# Altium schematic sheet Sheet1.SchDoc
size A4; SheetNumber: 1; SheetTotal: 1
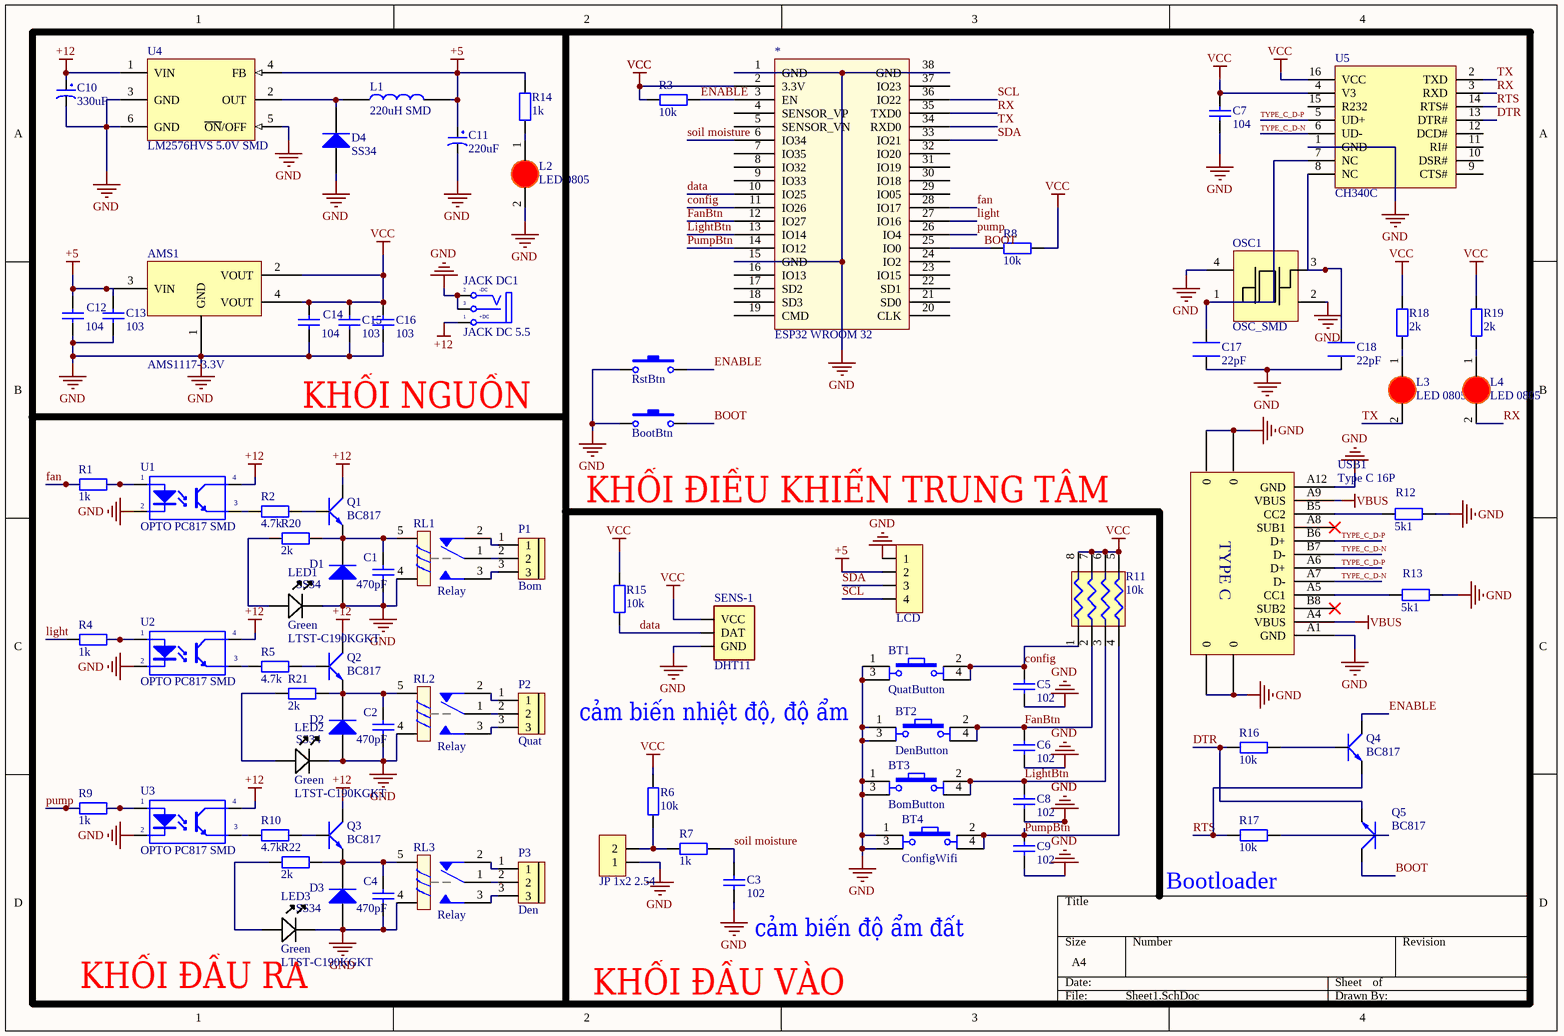
[diagram p0: Sheet1.SchDoc]

## Parts
*  ESP32 WROOM 32  [ESP32-WROOM-32D]
AMS1  AMS1117-3.3V  [SOT223]
BootBtn  Nut Nhan 2 Chan SMD 3x6x2.5  [Nut Nhan 2 Chan SMD 3x6x2.5]  (value not drawn)
BT1  QuatButton  [Nut Nhan 4 Chan SMD 6x6]
BT2  DenButton  [Nut Nhan 4 Chan SMD 6x6]
BT3  BomButton  [Nut Nhan 4 Chan SMD 6x6]
BT4  ConfigWifi  [Nut Nhan 4 Chan SMD 6x6]
C1  470pF  [tu 0603]
C2  470pF  [tu 0603]
C3  102  [tu 0603]
C4  470pF  [tu 0603]
C5  102  [tu 0603]
C6  102  [tu 0603]
C7  104  [tu 0603]
C8  102  [tu 0603]
C9  102  [tu 0603]
C10  330uF  [tu hoa 8mm]
C11  220uF  [tu hoa 6.5mm]
C12  104  [tu 0603]
C13  103  [tu 0603]
C14  104  [tu 0603]
C15  103  [tu 0603]
C16  103  [tu 0603]
C17  22pF  [CAPC1608X09L]
C18  22pF  [CAPC1608X09L]
D1  SS34  [DIODE SMA]
D2  SS34  [DIODE SMA]
D3  SS34  [DIODE SMA]
D4  SS34  [DIODE SMA]
JACK_DC1  JACK DC 5.5  [JACK DC 5.5]
JP1  JP 1x2 2.54  [JP 1x2 DT]
JP?  LCD  [JP 1x4 DT]
L1  220uH SMD  [Cuon Cam 7x7x5]
L2  LED 0805  [LED-0805-Red]
L3  LED 0805  [LED-0805-Red]
L4  LED 0805  [LED-0805-Red]
LED1  Green  [LED-0603-GREEN]
LED2  Green  [LED-0603-GREEN]
LED3  Green  [LED-0603-GREEN]
OSC1  OSC_SMD  [3525 OSC]
P1  Bom  [CON 3 3EDG5.08]
P2  Quat  [CON 3 3EDG5.08]
P3  Den  [CON 3 3EDG5.08]
Q1  BC817  [SOT-23]
Q2  BC817  [SOT-23]
Q3  BC817  [SOT-23]
Q4  BC817  [SOT-23]
Q5  BC817  [SOT-23]
R1  1k  [tro smd 0603]
R2  4.7k  [tro smd 0603]
R3  10k  [tro smd 0603]
R4  1k  [tro smd 0603]
R5  4.7k  [tro smd 0603]
R6  10k  [tro smd 0603]
R7  1k  [tro smd 0603]
R8  10k  [tro smd 0603]
R9  1k  [tro smd 0603]
R10  4.7k  [tro smd 0603]
R11  10k  [tro bang 0603 4]
R12  5k1  [tro smd 0603]
R13  5k1  [tro smd 0603]
R14  1k  [tro smd 0603]
R15  10k  [tro smd 0603]
R16  10k  [tro smd 0603]
R17  10k  [tro smd 0603]
R18  2k  [tro smd 0603]
R19  2k  [tro smd 0603]
R20  2k  [tro smd 0603]
R21  2k  [tro smd 0603]
R22  2k  [tro smd 0603]
RL1  Relay  [Relay 5 Chan SRD]
RL2  Relay  [Relay 5 Chan SRD]
RL3  Relay  [Relay 5 Chan SRD]
RstBtn  Nut Nhan 2 Chan SMD 3x6x2.5  [Nut Nhan 2 Chan SMD 3x6x2.5]  (value not drawn)
SENS-1  DHT11  [SENSOR-DHT11]
U1  OPTO PC817 SMD  [SOP4]
U2  OPTO PC817 SMD  [SOP4]
U3  OPTO PC817 SMD  [SOP4]
U4  LM2576HVS 5.0V SMD  [TO263-5]
U5  CH340C  [SOIC16_50_284_25X90_SMT]
USB1  Type C 16P  [Type C 16P]

## Nets
+5: AMS1.3(VIN) C11.1 C12.1 C13.1 JP?.2 L1.2 R14.2 U4.4(FB)
+12: C10.1 JACK_DC1.1(T) Q1.3(C) Q2.3(C) Q3.3(C) U1.4(C) U2.4(C) U3.4(C) U4.1(VIN)
GND: *.1(GND) *.15(GND) *.38(GND) AMS1.1(GND) BootBtn.1 BT1.1 BT1.3 BT2.1 BT2.3 BT3.1 BT3.3 BT4.1 BT4.3 C1.2 C2.2 C3.2 C4.2 C5.2 C6.2 C7.2 C8.2 C9.2 C10.2 C11.2 C12.2 C13.2 C14.2 C15.2 C16.2 C17.2 C18.2 D1.1(A) D2.1(A) D3.1(A) D4.1(A) JACK_DC1.2(TN) JACK_DC1.3(S) JP1.1 JP?.1 L2.2(K) LED1.K LED2.K LED3.K OSC1.2(VCC) OSC1.4(VCC) R12.2 R13.2 RL1.4 RL2.4 RL3.4 RstBtn.1 SENS-1.P$4(GND) U1.2(K) U2.2(K) U3.2(K) U4.3(GND) U4.5(~{ON}/OFF) U4.6(GND) U5.1(GND) USB1.0 USB1.A1(GND) USB1.A12(GND)
VBUS: USB1.A4(VBUS) USB1.A9(VBUS)
VCC: *.2(3.3V) AMS1.2(VOUT) AMS1.4(VOUT) C7.1 C14.1 C15.1 C16.1 R3.1 R6.2 R8.2 R11.5 R11.6 R11.7 R11.8 R15.2 R18.2 R19.2 SENS-1.P$1(VCC) U5.4(V3) U5.16(VCC)
BOOT: *.25(IO0) BootBtn.2 Q5.3(C) R8.1
config: *.11(IO26) BT1.2 BT1.4 C5.1 R11.1
data: *.10(IO25) R15.1 SENS-1.P$2(DAT)
DTR: Q5.2(E) R16.1 U5.13(DTR#)
ENABLE: *.3(EN) Q4.3(C) R3.2 RstBtn.2
fan: *.28(IO17) R1.1
FanBtn: *.12(IO27) BT2.2 BT2.4 C6.1 R11.2
light: *.27(IO16) R4.1
LightBtn: *.13(IO14) BT3.2 BT3.4 C8.1 R11.3
pump: *.26(IO4) R9.1
PumpBtn: *.14(IO12) BT4.2 BT4.4 C9.1 R11.4
RTS: Q4.2(E) R17.1 U5.14(RTS#)
RX: *.35(TXD0) L4.2(K) U5.3(RXD)
SCL: *.36(IO22) JP?.4
SDA: *.33(IO21) JP?.3
soil moisture: *.6(IO34) C3.1 R7.2
TX: *.34(RXD0) L3.2(K) U5.2(TXD)
TYPE_C_D-N: U5.6(UD-) USB1.A7(D-) USB1.B7(D-)
TYPE_C_D-P: U5.5(UD+) USB1.A6(D+) USB1.B6(D+)
NetC1_1: C1.1 D1.2(K) Q1.2(E) R20.2 RL1.5
NetC2_1: C2.1 D2.2(K) Q2.2(E) R21.2 RL2.5
NetC4_1: C4.1 D3.2(K) Q3.2(E) R22.2 RL3.5
NetC17_1: C17.1 OSC1.1(VCC) U5.7(NC)
NetC18_1: C18.1 OSC1.3(VCC) U5.8(NC)
NetD4_2: D4.2(K) L1.1 U4.2(OUT)
NetJP1_2: JP1.2 R6.1 R7.1
NetL2_1: L2.1(A) R14.1
NetL3_1: L3.1(A) R18.1
NetL4_1: L4.1(A) R19.1
NetLED1_A: LED1.A R20.1
NetLED2_A: LED2.A R21.1
NetLED3_A: LED3.A R22.1
NetP1_1: P1.1 RL1.2
NetP1_2: P1.2 RL1.1
NetP1_3: P1.3 RL1.3
NetP2_1: P2.1 RL2.2
NetP2_2: P2.2 RL2.1
NetP2_3: P2.3 RL2.3
NetP3_1: P3.1 RL3.2
NetP3_2: P3.2 RL3.1
NetP3_3: P3.3 RL3.3
NetQ1_1: Q1.1(B) R2.2
NetQ2_1: Q2.1(B) R5.2
NetQ3_1: Q3.1(B) R10.2
NetQ4_1: Q4.1(B) R16.2
NetQ5_1: Q5.1(B) R17.2
NetR1_2: R1.2 U1.1(A)
NetR2_1: R2.1 U1.3(E)
NetR4_2: R4.2 U2.1(A)
NetR5_1: R5.1 U2.3(E)
NetR9_2: R9.2 U3.1(A)
NetR10_1: R10.1 U3.3(E)
NetR12_1: R12.1 USB1.B5(CC2)
NetR13_1: R13.1 USB1.A5(CC1)

Not connected (* = marked no-connect by the designer): * 4(SENSOR_VP) 5(SENSOR_VN) 7(IO35) 8(IO32) 9(IO33) 16(IO13) 17(SD2) 18(SD3) 19(CMD) 20(CLK) 21(SD0) 22(SD1) 23(IO15) 24(IO2) 29(IO05) 30(IO18) 31(IO19) 32(IO20) 37(IO23); U5 9(CTS#) 10(DSR#) 11(RI#) 12(DCD#) 15(R232); USB1 A8(SUB1)* B8(SUB2)*

## Notes on the sheet
- KHỐI NGUỒN
- KHỐI ĐIỀU KHIỂN TRUNG TÂM
- cảm biến nhiệt độ, độ ẩm
- (near R17) Bootloader
- (near C3) cảm biến độ ẩm đất
- (near LED3) KHỐI ĐẦU RA
- KHỐI ĐẦU VÀO
- (in symbol JACK DC 5.5) -DC; +DC
- (in symbol Type C 16P) TYPE C

## Library data of the parts
AMS1 = AMS1117 SMD: Dán; Value: AMS1117-3.3V SOT223; Don_Vi: Con; Ma_Hang: MH000596; Ghi_Chu: *; Kieu_Chan: *; Chung_Loai: Dán
BootBtn RstBtn = Nut Nhan 2 Chan SMD 3x6x2.5: Ma_Hang: MH001036; Ten: Nút Nhấn 2 Chân 3x6x2.5MM SMD
BT1-BT4 = Nut Nhan 4 Chan SMD 6x6: Nut Nhan 4 Chan 6.2x6.2x3.5; Ten: Nút Nhấn 4 Chân 6.2x6.2x3.1MM SMD; Ma_Hang: MH002424
C1 C2 C4 = Tu 0603 470pF 50V 10%: Dán; Don_Vi: Con; So_Chan: 2; Ten_Linh_Kien: Tụ 0603 470P 50V 10%; Ma_Hang: MH004571; Chung_Loai: Dán; Kieu_Chan: *
C3 C5 C6 C8 C9 = Tu 0603 102 50V 10%: Dán; Don_Vi: Con; So_Chan: 2; Ten_Linh_Kien: Tụ 0603 102-1nF 10% 50V; Ma_Hang: MH004566; Chung_Loai: Dán; Kieu_Chan: *
C7 C12 C14 = Tu 0603 104 50V 10%: Dán; Don_Vi: Con; So_Chan: 2; Ten_Linh_Kien: Tụ 0603 104-100nF 10% 50V; Ma_Hang: MH004568; Chung_Loai: Dán; Kieu_Chan: *
C10 = Tu Hoa 330uF 25V 8x11: Cắm; Don_Vi: Con; So_Chan: 2; Ten_Linh_Kien: Tụ Hóa 330nF 25V 8x11MM; Ma_Hang: MH006566; Chung_Loai: Cắm; Kieu_Chan: *
C11 = Tu Hoa 220uF 16V 7x11: Cắm; Don_Vi: Con; Ten_Linh_Kien: Tụ Hóa 220uF 16V 7x11MM; So_Chan: 2; Ma_Hang: MH008416; Chung_Loai: Cắm; Kieu_Chan: *
C13 C15 C16 = Tu 0603 103 50V 10%: Dán; Don_Vi: Con; So_Chan: 2; Ten_Linh_Kien: Tụ 0603 103-10nF 10% 50V; Ma_Hang: MH004567; Chung_Loai: Dán; Kieu_Chan: *
C17 C18 = GRM1885C1H222JA01D: CAP CER 2200PF 50V NP0 0603; Manufacturer: Murata Electronics North America; Tolerance: ±5%; Temperature Coefficient: C0G, NP0; Supplier 1: Digi-Key; Supplier Part Number 1: 490-1459-1-ND; RoHS: RoHS Compliant; Category: Capacitors; Stock 1: 850589; Pricing 1: 1=0.11, 10=0.08, 25=0.058, 50=0.0434, 100=0.0355, 250=0.02972, 500=0.02536, 1000=0.01992 (USD); Packaging: Cut Tape (CT); Capacitance: 2200pF; Voltage - Rated: 50V; Mounting Type: Surface Mount, MLCC; Operating Temperature: -55°C ~ 125°C; Applications: General Purpose; Ratings: -; Package / Case: 0603 (1608 Metric); Size / Dimension: 0.063" L x 0.031" W (1.60mm x 0.80mm); Height - Seated (Max): -; Thickness (Max): 0.035" (0.90mm); Lead Spacing: -; Features: -; Lead Style: -; ComponentLink1URL: http://www.murata.com/~/media/webrenewal/support/library/catalog/products/capacitor/mlcc/c02e.ashx; ComponentLink1Description: http://www.murata.com/~/media/webrenewal/support/library/catalog/products/capacitor/mlcc/c02e.ashx; Part Status: Active
D1-D4 = Diode SS34 ( 1N5822 ): Dán; Don_Vi: Con; Ma_Hang: MH002104; Ten_Linh_Kien: Diode SS34 3A 40V SMA ( 1N5822 SS34A); Kieu_Chan: *; Chung_Loai: Dán
JACK_DC1 = JACK DC 5.5: Value: Jac DC
JP1 = JP 1x2 2.54 Duc Thang: Cắm; Ten_Linh_Kien: Jump Đơn Đực 2.54MM 1x40P Thẳng 11MM; Don_Vi: Con; Ma_Hang: MH000903; Ghi_Chu: *; Kieu_Chan: *; Chung_Loai: Cắm
JP? = JP 1x4 2.54 Duc Thang: Cắm; Ten_Linh_Kien: Jump Đơn Đực 2.54MM 1x40P Thẳng 11MM; Don_Vi: Con; Ma_Hang: MH000903; Ghi_Chu: *; Kieu_Chan: *; Chung_Loai: Cắm
L1 = CUON CAM 47uH SMD: Dán; Don_Vi: Con; Ma_Hang: MH004211; Ten_Linh_Kien: Cuộn Cảm 47uH 7x7x4MM CD74R; Ghi_Chu: *; Kieu_Chan: *; Chung_Loai: Dán
L2-L4 = LED 0805 Do: Dán; Don_Vi: Con; Ma_Hang: MH000897; Ten_Linh_Kien: LED 0805 Màu Đỏ (Red); Ghi_Chu: *; Kieu_Chan: *; Chung_Loai: Dán
LED1-LED3 = LTST-C190KGKT: LED GREEN CLEAR 0603 SMD; Manufacturer: Lite-On Inc.; Lens Color: Colorless; Millicandela Rating: 35mcd; Lens Style/Size: Rectangle with Flat Top, 1.10mm x 0.80mm; Voltage - Forward (Vf) (Typ): 2V; Current - Test: 20mA; Viewing Angle: 130°; Wavelength - Dominant: 571nm; Wavelength - Peak: 574nm; Supplier 1: Digi-Key; Supplier Part Number 1: 160-1435-1-ND; RoHS: RoHS Compliant; Category: Optoelectronics; Stock: 922756; Pricing 1: 1=0.27, 10=0.196, 25=0.1448, 100=0.1034, 250=0.07032, 500=0.06204, 1000=0.0486 (USD); Packaging: Cut Tape (CT); Part Status: Active; Color: Green; Lens Transparency: Clear; Mounting Type: Surface Mount; Features: -; Package / Case: 0603 (1608 Metric); Size / Dimension: 1.60mm L x 0.80mm W; Height (Max): 0.80mm; ComponentLink1URL: http://optoelectronics.liteon.com/upload/download/DS22-2000-074/S_110_LTST-C190KGKT.pdf; ComponentLink1Description: http://optoelectronics.liteon.com/upload/download/DS22-2000-074/S_110_LTST-C190KGKT.pdf; Manufacturer Part Number: LTST-C190KGKT
P1-P3 = CON 3 EDG5.08: Cắm; Ten_Linh_Kien: CON 3 2EDG5.08-3P 5.08MM ( Xanh Cong); Don_Vi: Con; Ma_Hang: MH000760; Ghi_Chu: *; Kieu_Chan: *; Chung_Loai: Cắm
Q1-Q5 = Trans BC817: SOT-23 - C8658; Value: C9014
R1 R4 R7 R9 R14 = Tro 0603 5% 1k: Dán; Don_Vi: Con; So_Chan: 2; Ten_Linh_Kien: Trở 0603 5% 1k; Ma_Hang: MH006319; Chung_Loai: Dán; Kieu_Chan: *
R2 R5 R10 = Tro 0603 5% 4.7k: Dán; Don_Vi: Con; So_Chan: 2; Ten_Linh_Kien: Trở 0603 5% 4.7k; Ma_Hang: MH006327; Chung_Loai: Dán; Kieu_Chan: *
R3 R6 R8 R15-R17 = Tro 0603 5% 10k: Dán; Don_Vi: Con; So_Chan: 2; Ten_Linh_Kien: Trở 0603 5% 10k; Ma_Hang: MH006316; Chung_Loai: Dán; Kieu_Chan: *
R11 = Tro bang 0603 10k: Dán; Don_Vi: Con; So_Chan: 8; Ten_Linh_Kien: Trở băng 0603x4 10k; Ma_Hang: MH001444; Chung_Loai: Dán; Kieu_Chan: *
R12 R13 = Tro 0603 5% 51k: Dán; Don_Vi: Con; So_Chan: 2; Ten_Linh_Kien: Trở 0603 5% 51k; Ma_Hang: MH007666; Chung_Loai: Dán; Kieu_Chan: *
R18-R22 = Tro 0603 5% 2k: Dán; Don_Vi: Con; So_Chan: 2; Ten_Linh_Kien: Trở 0603 5% 2k; Ma_Hang: MH006324; Chung_Loai: Dán; Kieu_Chan: *
RL1-RL3 = Relay 5 Chan SRD: Relay 5 Chan; Ma_Hang: MH009374; Ten: Relay 5V10A SRD-05VDC-SL-C Chính Hãng
SENS-1 = DHT11: Temperature Humidity Sensor 16bi; MF: aosong; SnapEDA_Link: https://www.snapeda.com/parts/DHT11/Aosong+Electronics/view-part/?ref=snap; Package: None; Value: *; MP: DHT11; Check_prices: https://www.snapeda.com/parts/DHT11/Aosong+Electronics/view-part/?ref=eda
U1-U3 = OPTO PC817 SMD: Single Opto; Value: PC817
U4 = LM2576HVS 5.0V SMD: Dán; Ten_Linh_Kien: LM2576HVS-5.0V BUCK 5V 3A TO263-5; Don_Vi: Con; Ma_Hang: MH002362; Ghi_Chu: *; Kieu_Chan: *; Chung_Loai: Dán
U5 = CH340C: USB Bridge, USB to UART USB 2.0 UART Interface; Manufacturer: Olimex; Alternate Part Number-1: NA; Manufacturer Part Number: CH340C; Case/Package: SOIC16; Supplier-1: LCSC; Supplier Part Number-1: C84681